# Altium schematic sheet DSP_Power&Analog.SchDoc
size A4
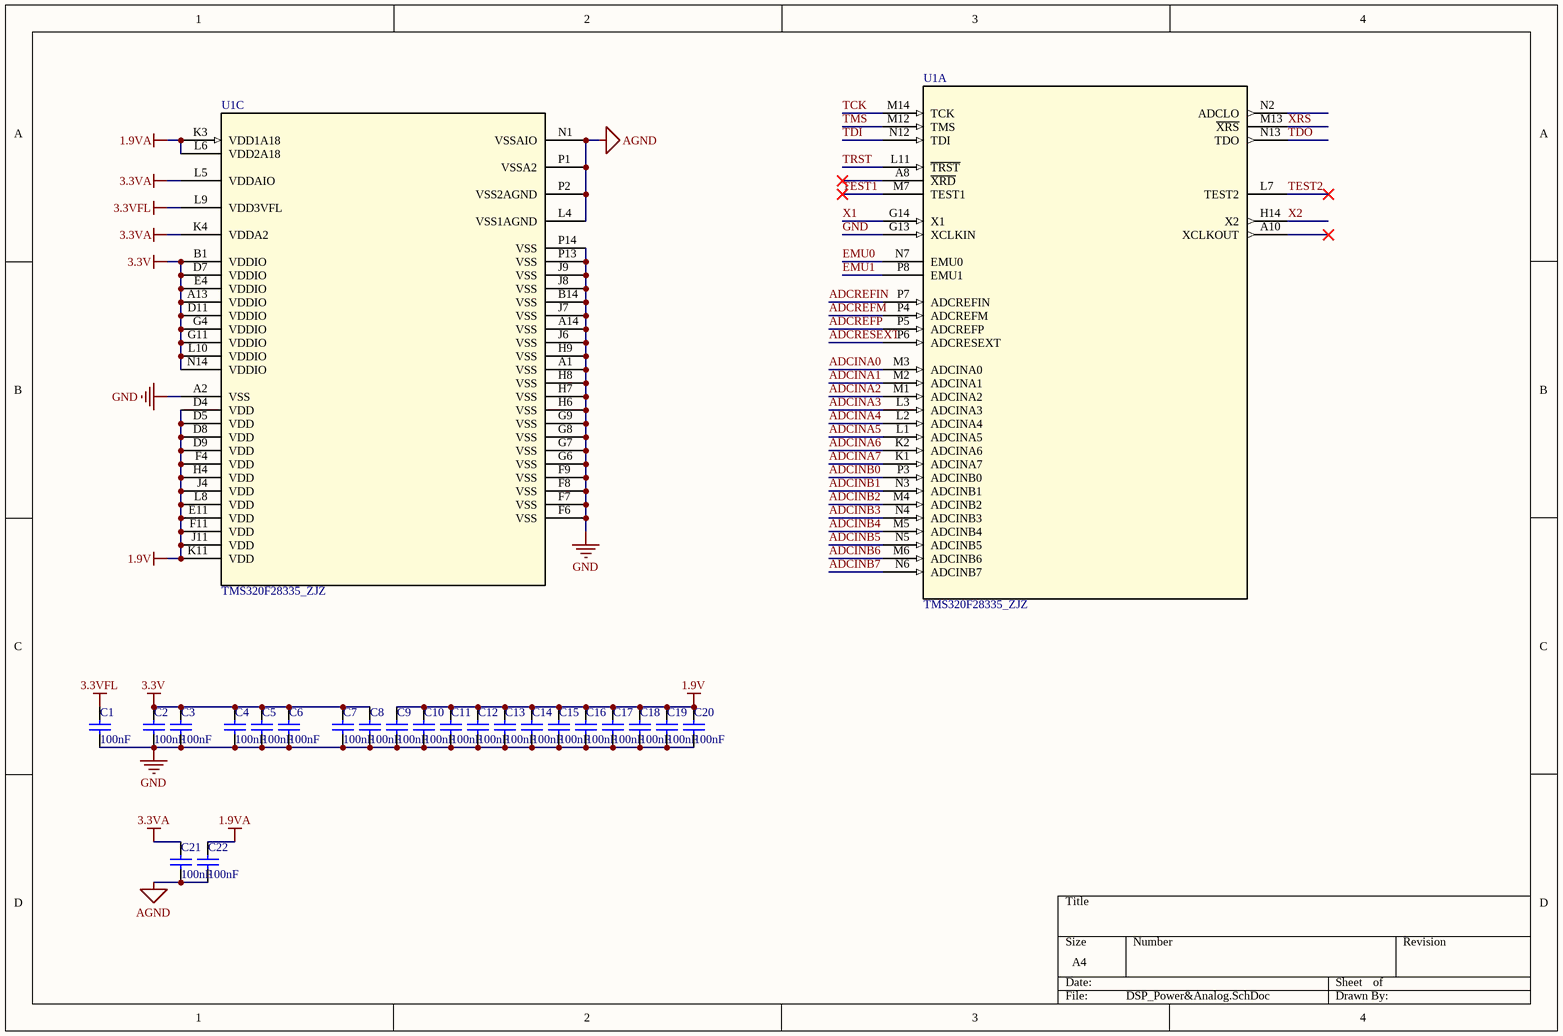
[diagram p0: DSP_Power&Analog.SchDoc]

## Parts
C1  value 100nF  [C0402]  (hidden comment: Cap)
C2  value 100nF  [C0402]  (hidden comment: Cap)
C3  value 100nF  [C0402]  (hidden comment: Cap)
C4  value 100nF  [C0402]  (hidden comment: Cap)
C5  value 100nF  [C0402]  (hidden comment: Cap)
C6  value 100nF  [C0402]  (hidden comment: Cap)
C7  value 100nF  [C0603]  (hidden comment: Cap)
C8  value 100nF  [C0603]  (hidden comment: Cap)
C9  value 100nF  [C0402]  (hidden comment: Cap)
C10  value 100nF  [C0402]  (hidden comment: Cap)
C11  value 100nF  [C0402]  (hidden comment: Cap)
C12  value 100nF  [C0402]  (hidden comment: Cap)
C13  value 100nF  [C0402]  (hidden comment: Cap)
C14  value 100nF  [C0402]  (hidden comment: Cap)
C15  value 100nF  [C0402]  (hidden comment: Cap)
C16  value 100nF  [C0402]  (hidden comment: Cap)
C17  value 100nF  [C0402]  (hidden comment: Cap)
C18  value 100nF  [C0402]  (hidden comment: Cap)
C19  value 100nF  [C0402]  (hidden comment: Cap)
C20  value 100nF  [C0402]  (hidden comment: Cap)
C21  value 100nF  [C0402]  (hidden comment: Cap)
C22  value 100nF  [C0402]  (hidden comment: Cap)
U1  TMS320F28335_ZJZ  [ZJZ176]  (parts A,C of 3)

## Nets
1.9V: C9.1 C10.1 C11.1 C12.1 C13.1 C14.1 C15.1 C16.1 C17.1 C18.1 C19.1 C20.1 U1.D4(VDD) U1.D5(VDD) U1.D8(VDD) U1.D9(VDD) U1.E11(VDD) U1.F4(VDD) U1.F11(VDD) U1.H4(VDD) U1.J4(VDD) U1.J11(VDD) U1.K11(VDD) U1.L8(VDD)
1.9VA: C22.1 U1.K3(VDD1A18) U1.L6(VDD2A18)
3.3V: C2.1 C3.1 C4.1 C5.1 C6.1 C7.1 C8.1 U1.A13(VDDIO) U1.B1(VDDIO) U1.D7(VDDIO) U1.D11(VDDIO) U1.E4(VDDIO) U1.G4(VDDIO) U1.G11(VDDIO) U1.L10(VDDIO) U1.N14(VDDIO)
3.3VA: C21.1 U1.K4(VDDA2) U1.L5(VDDAIO)
3.3VFL: C1.1 U1.L9(VDD3VFL)
AGND: C21.2 C22.2 U1.L4(VSS1AGND) U1.N1(VSSAIO) U1.P1(VSSA2) U1.P2(VSS2AGND)
GND: C1.2 C2.2 C3.2 C4.2 C5.2 C6.2 C7.2 C8.2 C9.2 C10.2 C11.2 C12.2 C13.2 C14.2 C15.2 C16.2 C17.2 C18.2 C19.2 C20.2 U1.A1(VSS) U1.A2(VSS) U1.A14(VSS) U1.B14(VSS) U1.F6(VSS) U1.F7(VSS) U1.F8(VSS) U1.F9(VSS) U1.G6(VSS) U1.G7(VSS) U1.G8(VSS) U1.G9(VSS) U1.G13(XCLKIN) U1.H6(VSS) U1.H7(VSS) U1.H8(VSS) U1.H9(VSS) U1.J6(VSS) U1.J7(VSS) U1.J8(VSS) U1.J9(VSS) U1.P13(VSS) U1.P14(VSS)
ADCINA0: U1.M3(ADCINA0)
ADCINA1: U1.M2(ADCINA1)
ADCINA2: U1.M1(ADCINA2)
ADCINA3: U1.L3(ADCINA3)
ADCINA4: U1.L2(ADCINA4)
ADCINA5: U1.L1(ADCINA5)
ADCINA6: U1.K2(ADCINA6)
ADCINA7: U1.K1(ADCINA7)
ADCINB0: U1.P3(ADCINB0)
ADCINB1: U1.N3(ADCINB1)
ADCINB2: U1.M4(ADCINB2)
ADCINB3: U1.N4(ADCINB3)
ADCINB4: U1.M5(ADCINB4)
ADCINB5: U1.N5(ADCINB5)
ADCINB6: U1.M6(ADCINB6)
ADCINB7: U1.N6(ADCINB7)
ADCREFIN: U1.P7(ADCREFIN)
ADCREFM: U1.P4(ADCREFM)
ADCREFP: U1.P5(ADCREFP)
ADCRESEXT: U1.P6(ADCRESEXT)
EMU0: U1.N7(EMU0)
EMU1: U1.P8(EMU1)
TCK: U1.M14(TCK)
TDI: U1.N12(TDI)
TDO: U1.N13(TDO)
TEST1: U1.M7(TEST1)
TEST2: U1.L7(TEST2)
TMS: U1.M12(TMS)
TRST: U1.L11(~{TRST})
X1: U1.G14(X1)
X2: U1.H14(X2)
XRS: U1.M13(~{XRS})

Not connected (* = marked no-connect by the designer): U1 A8(~{XRD})* A10(XCLKOUT)* N2(ADCLO)

## Library data of the parts
C1-C22 = Cap: Capacitor; Published: 8-Jun-2000; LatestRevisionDate: 17-Jul-2002; LatestRevisionNote: Re-released for DXP Platform.; PackageReference: RAD-0.3; Publisher: Altium Limited; PackageDescription: Radial Cap, Thru-Hole; 2 Leads; 0.3 in Pin Spacing
U1 = TMS320F28335_ZJZ: Imported; Manufacturer: Texas Instruments; Manufacturer_Part_Number: tms320f28335_zjz_176; INDUSTRY_STD_PKG_TYPE: BGA; FAMILY_NAME: 28X DELFINO&#153; FLOATING-POINT SERIES; PIN_COUNT: 176; PACKAGE_DESIGNATOR: ZJZ; Vendor: Texas Instuments; Datasheet_URL: http://www.ti.com/lit/gpn/TMS320F28335; GENERIC_PART_NUMBER: TMS320F28335; Value: Value; Type: Type; RefDes: RefDes